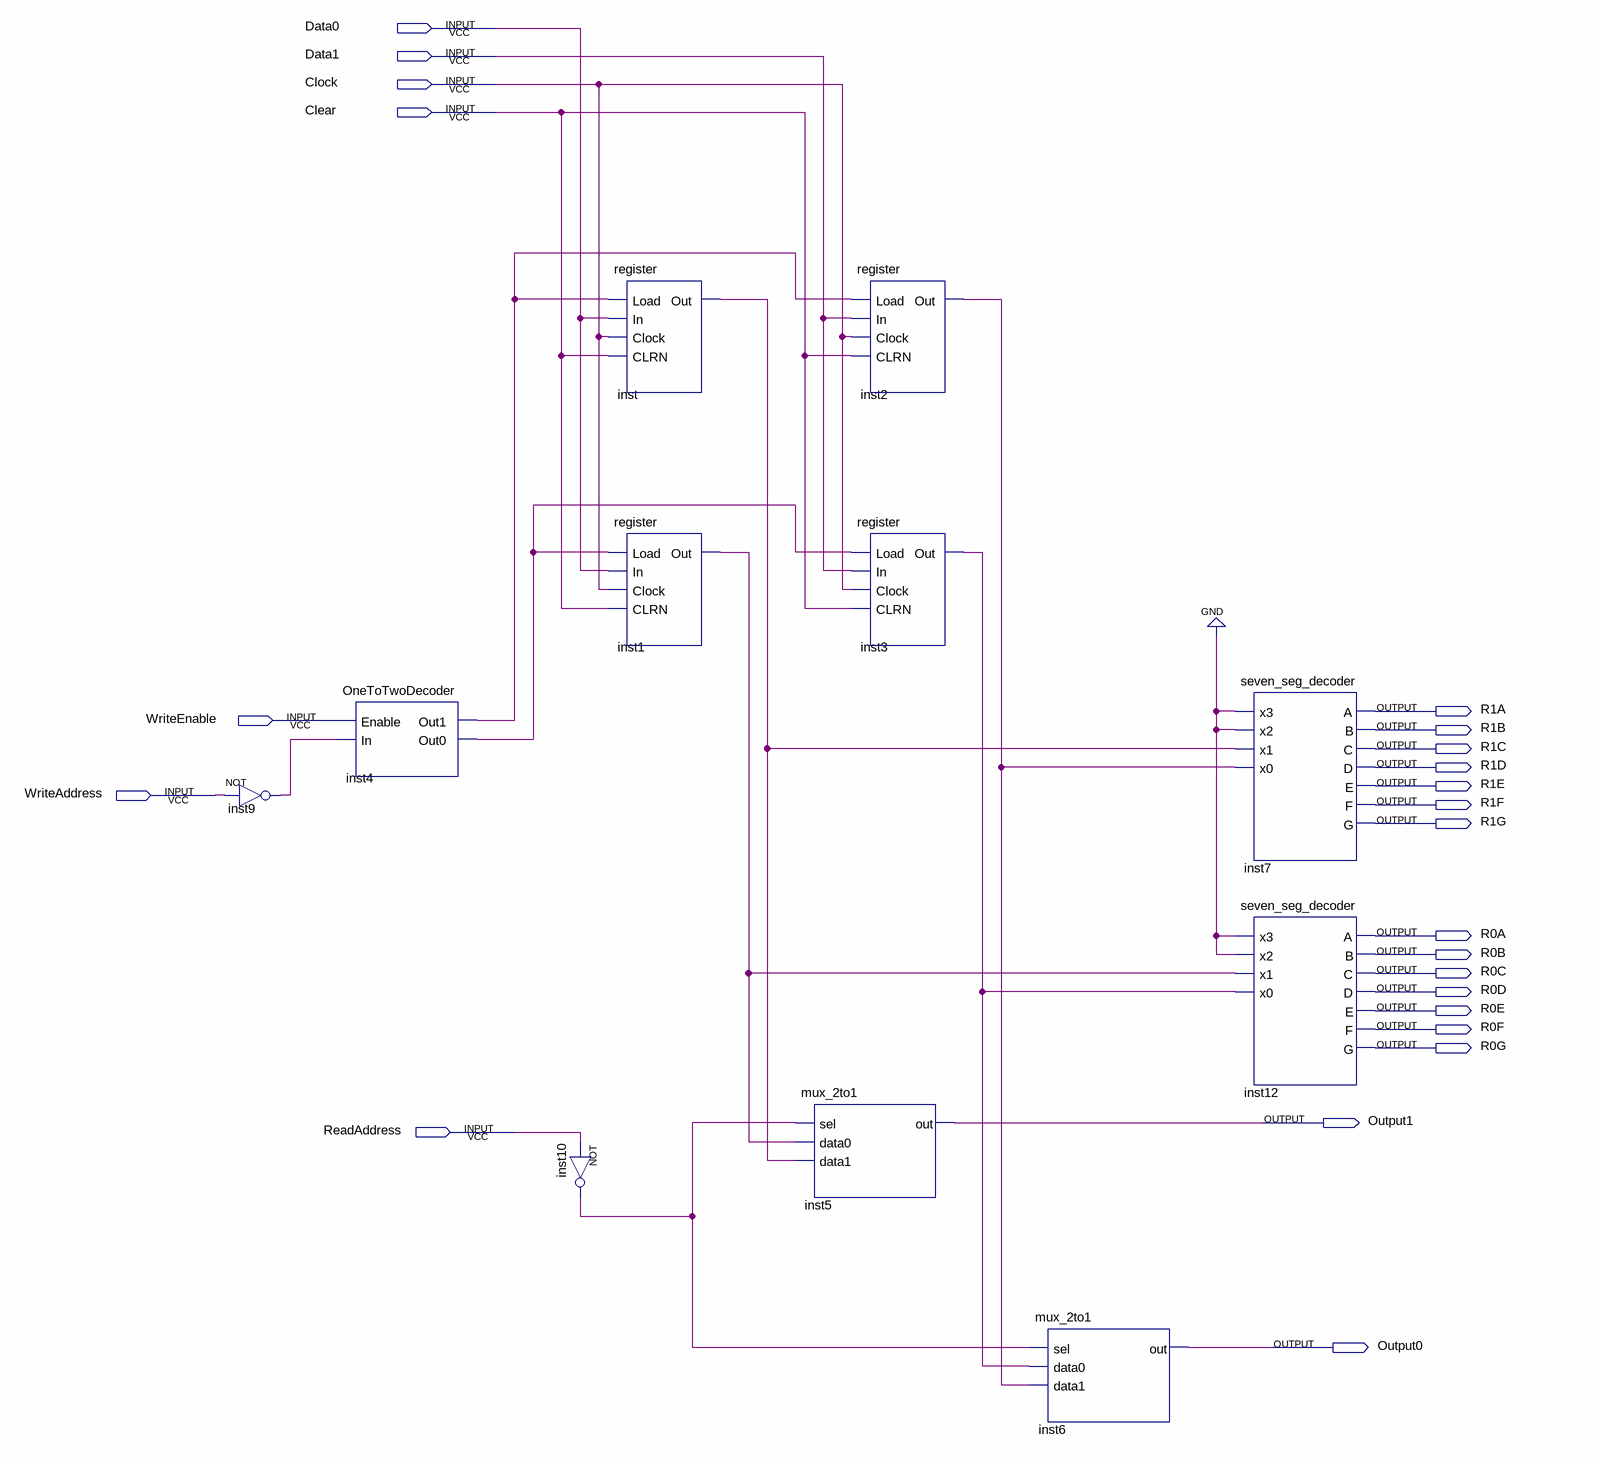
[diagram p0: schematic sheet]
// Quartus schematic registerFile.bdf as structural Verilog: 11 symbols, 23 pins
module registerFile (
  input  Data0,
  input  Data1,
  input  Clock,
  input  Clear,
  input  WriteEnable,
  input  WriteAddress,
  input  ReadAddress,
  output R1A,
  output R1B,
  output R1C,
  output R1D,
  output R1E,
  output R1F,
  output R1G,
  output R0A,
  output R0B,
  output R0C,
  output R0D,
  output R0E,
  output R0F,
  output R0G,
  output Output1,
  output Output0
);

  wire inst1_out, inst2_out, inst3_out, inst4_out0, inst4_out1, inst9_out, inst10_out, inst_out;

  not inst9 (inst9_out, WriteAddress);
  OneToTwoDecoder inst4 (.Enable(WriteEnable), .In(inst9_out), .Out1(inst4_out1), .Out0(inst4_out0));
  register inst (.Load(inst4_out1), .In(Data0), .Clock(Clock), .CLRN(Clear), .Out(inst_out));
  register inst1 (.Load(inst4_out0), .In(Data0), .Clock(Clock), .CLRN(Clear), .Out(inst1_out));
  not inst10 (inst10_out, ReadAddress);
  mux_2to1 inst5 (.sel(inst10_out), .data0(inst1_out), .data1(inst_out), .out(Output1));
  register inst2 (.Load(inst4_out1), .In(Data1), .Clock(Clock), .CLRN(Clear), .Out(inst2_out));
  register inst3 (.Load(inst4_out0), .In(Data1), .Clock(Clock), .CLRN(Clear), .Out(inst3_out));
  mux_2to1 inst6 (.sel(inst10_out), .data0(inst3_out), .data1(inst2_out), .out(Output0));
  seven_seg_decoder inst7 (
    .x3(1'b0), .x2(1'b0), .x1(inst_out), .x0(inst2_out), .A(R1A), .B(R1B), .C(R1C), .D(R1D), .E(R1E),
    .F(R1F), .G(R1G));
  seven_seg_decoder inst12 (
    .x3(1'b0), .x2(1'b0), .x1(inst1_out), .x0(inst3_out), .A(R0A), .B(R0B), .C(R0C), .D(R0D), .E(R0E),
    .F(R0F), .G(R0G));
endmodule
